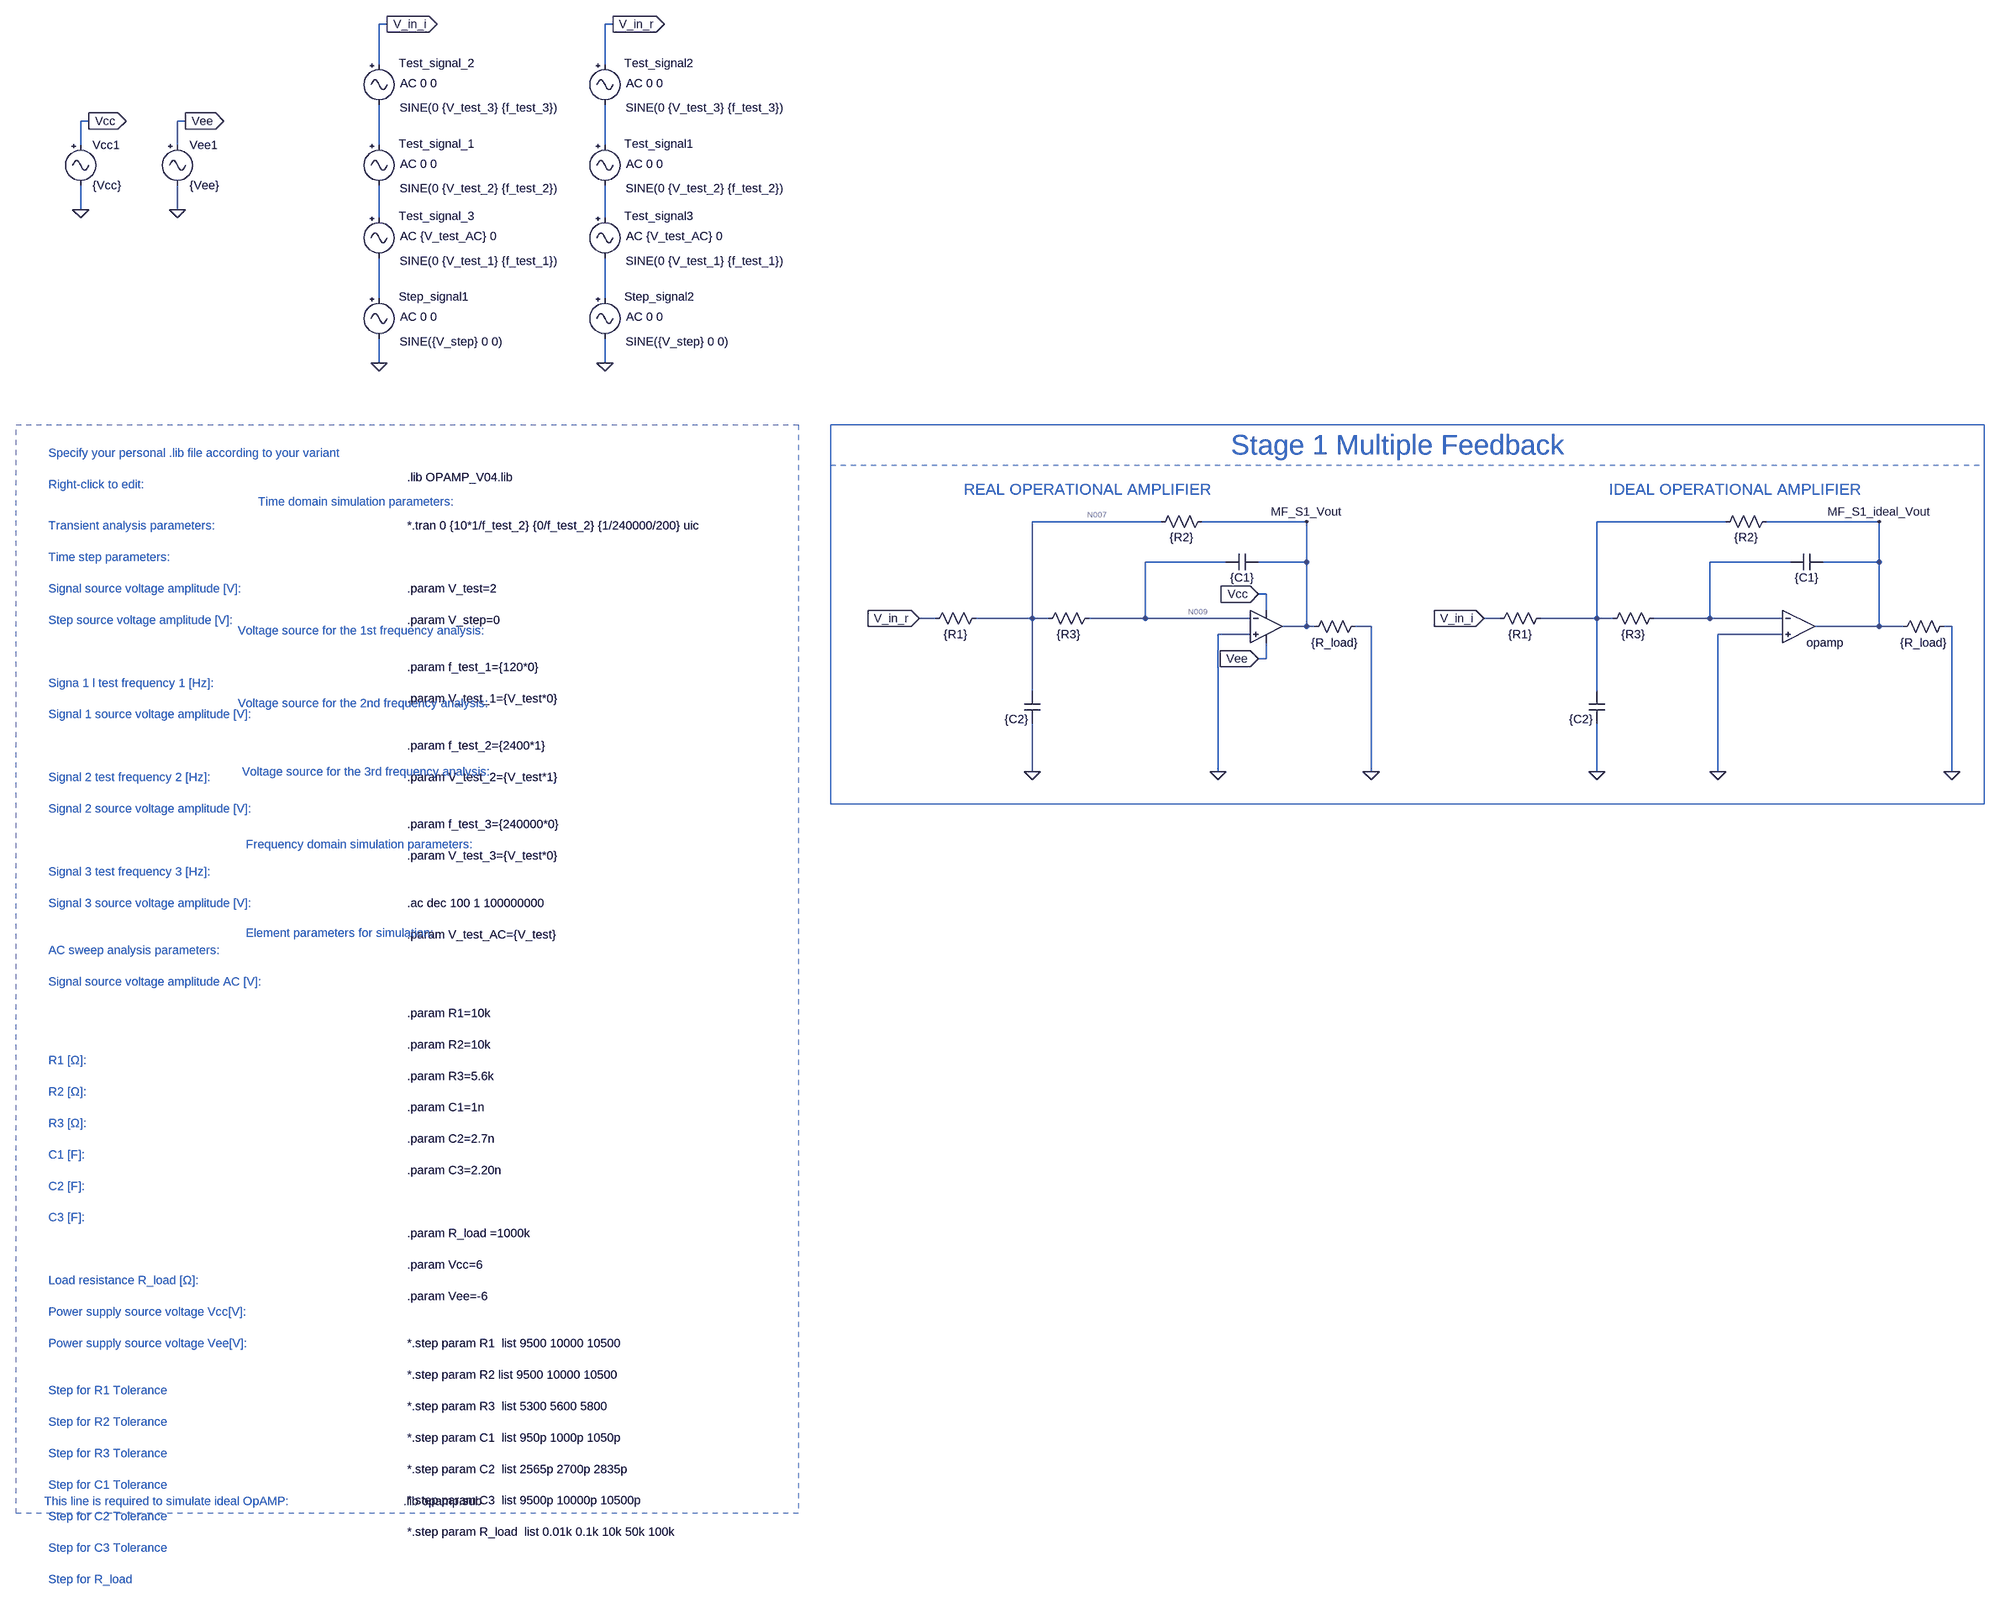
[diagram p0: schematic Lab3. OpAmp_Filter_v2.0.asc]
Lab3. OpAmp_Filter_v2.0.asc, the LTspice schematic file:
Version 4
SHEET 1 6772 2844
WIRE -1392 -1440 -1408 -1440
WIRE -944 -1440 -960 -1440
WIRE -1408 -1360 -1408 -1440
WIRE -960 -1360 -960 -1440
WIRE -1984 -1248 -2000 -1248
WIRE -1792 -1248 -1808 -1248
WIRE -2000 -1200 -2000 -1248
WIRE -1808 -1200 -1808 -1248
WIRE -1408 -1200 -1408 -1280
WIRE -960 -1200 -960 -1280
WIRE -2000 -1072 -2000 -1120
WIRE -1808 -1072 -1808 -1120
WIRE -1408 -1056 -1408 -1120
WIRE -960 -1056 -960 -1120
WIRE -1408 -896 -1408 -976
WIRE -960 -896 -960 -976
WIRE -1408 -768 -1408 -816
WIRE -960 -768 -960 -816
WIRE 144 -448 -112 -448
WIRE 432 -448 224 -448
WIRE 1264 -448 1008 -448
WIRE 1568 -448 1344 -448
WIRE 272 -368 112 -368
WIRE 432 -368 432 -448
WIRE 432 -368 336 -368
WIRE 1392 -368 1232 -368
WIRE 1568 -368 1568 -448
WIRE 1568 -368 1456 -368
WIRE 352 -304 336 -304
WIRE 352 -272 352 -304
WIRE -304 -256 -336 -256
WIRE -112 -256 -112 -448
WIRE -112 -256 -224 -256
WIRE -80 -256 -112 -256
WIRE 112 -256 112 -368
WIRE 112 -256 0 -256
WIRE 320 -256 112 -256
WIRE 816 -256 784 -256
WIRE 1008 -256 1008 -448
WIRE 1008 -256 896 -256
WIRE 1040 -256 1008 -256
WIRE 1232 -256 1232 -368
WIRE 1232 -256 1120 -256
WIRE 1376 -256 1232 -256
WIRE 432 -240 432 -368
WIRE 432 -240 384 -240
WIRE 448 -240 432 -240
WIRE 560 -240 528 -240
WIRE 1568 -240 1568 -368
WIRE 1568 -240 1440 -240
WIRE 1616 -240 1568 -240
WIRE 1712 -240 1696 -240
WIRE 320 -224 256 -224
WIRE 1376 -224 1248 -224
WIRE 352 -176 352 -208
WIRE 352 -176 336 -176
WIRE -112 -112 -112 -256
WIRE 1008 -112 1008 -256
WIRE -112 48 -112 -48
WIRE 256 48 256 -224
WIRE 560 48 560 -240
WIRE 1008 48 1008 -48
WIRE 1248 48 1248 -224
WIRE 1712 48 1712 -240
FLAG 256 48 0
FLAG 336 -304 Vcc
IOPIN 336 -304 In
FLAG 336 -176 Vee
IOPIN 336 -176 In
FLAG 432 -448 MF_S1_Vout
FLAG -336 -256 V_in_r
IOPIN -336 -256 In
FLAG 560 48 0
FLAG -112 48 0
FLAG 1248 48 0
FLAG 1568 -448 MF_S1_ideal_Vout
FLAG 784 -256 V_in_i
IOPIN 784 -256 In
FLAG 1712 48 0
FLAG 1008 48 0
FLAG -2000 -1072 0
FLAG -1808 -1072 0
FLAG -1984 -1248 Vcc
IOPIN -1984 -1248 Out
FLAG -1792 -1248 Vee
IOPIN -1792 -1248 Out
FLAG -1408 -768 0
FLAG -1392 -1440 V_in_i
IOPIN -1392 -1440 Out
FLAG -960 -768 0
FLAG -944 -1440 V_in_r
IOPIN -944 -1440 Out
SYMBOL OpAmps\\opamp2 352 -304 R0
WINDOW 0 16 32 Invisible 2
WINDOW 3 16 96 Invisible 2
SYMATTR InstName U3
SYMATTR Value OPAMP_VarNo
SYMBOL res 544 -256 R90
WINDOW 0 0 56 Invisible 2
WINDOW 3 33 56 VTop 2
SYMATTR InstName R10
SYMATTR Value {R_load}
SYMBOL res 1712 -256 R90
WINDOW 0 0 56 Invisible 2
WINDOW 3 33 56 VTop 2
SYMATTR InstName R31
SYMATTR Value {R_load}
SYMBOL OpAmps\\opamp 1408 -304 R0
WINDOW 0 0 32 Invisible 2
SYMATTR InstName U4
SYMATTR SpiceLine2 GBW=100Meg
SYMBOL res -208 -272 R90
WINDOW 0 0 56 Invisible 2
WINDOW 3 32 56 VTop 2
SYMATTR InstName R32
SYMATTR Value {R1}
SYMATTR SpiceLine tol=10
SYMBOL res 240 -464 R90
WINDOW 0 0 56 Invisible 2
WINDOW 3 32 56 VTop 2
SYMATTR InstName R33
SYMATTR Value {R2}
SYMBOL cap 336 -384 R90
WINDOW 0 0 32 Invisible 2
WINDOW 3 32 32 VTop 2
SYMATTR InstName C20
SYMATTR Value {C1}
SYMBOL cap 1456 -384 R90
WINDOW 0 0 32 Invisible 2
WINDOW 3 32 32 VTop 2
SYMATTR InstName C21
SYMATTR Value {C1}
SYMBOL res 1360 -464 R90
WINDOW 0 0 56 Invisible 2
WINDOW 3 32 56 VTop 2
SYMATTR InstName R34
SYMATTR Value {R2}
SYMBOL res 1136 -272 R90
WINDOW 0 0 56 Invisible 2
WINDOW 3 32 56 VTop 2
SYMATTR InstName R35
SYMATTR Value {R3}
SYMBOL res 912 -272 R90
WINDOW 0 0 56 Invisible 2
WINDOW 3 32 56 VTop 2
SYMATTR InstName R36
SYMATTR Value {R1}
SYMATTR SpiceLine tol=10
SYMBOL res 16 -272 R90
WINDOW 0 0 56 Invisible 2
WINDOW 3 32 56 VTop 2
SYMATTR InstName R37
SYMATTR Value {R3}
SYMBOL cap -96 -48 R180
WINDOW 0 24 56 Invisible 2
WINDOW 3 24 8 Left 2
SYMATTR InstName C22
SYMATTR Value {C2}
SYMBOL cap 1024 -48 R180
WINDOW 0 24 56 Invisible 2
WINDOW 3 24 8 Left 2
SYMATTR InstName C23
SYMATTR Value {C2}
SYMBOL Misc\\signal -1408 -912 R0
WINDOW 123 42 53 Left 2
WINDOW 39 0 0 Left 0
WINDOW 0 39 13 Left 2
WINDOW 3 41 102 Left 2
SYMATTR Value2 AC 0 0
SYMATTR InstName Step_signal1
SYMATTR Value SINE({V_step} 0 0)
SYMBOL Misc\\signal -1808 -1216 R0
WINDOW 123 0 0 Left 0
WINDOW 39 0 0 Left 0
SYMATTR InstName Vee1
SYMATTR Value {Vee}
SYMBOL Misc\\signal -2000 -1216 R0
WINDOW 123 0 0 Left 0
WINDOW 39 0 0 Left 0
SYMATTR InstName Vcc1
SYMATTR Value {Vcc}
SYMBOL Misc\\signal -1408 -1216 R0
WINDOW 123 42 53 Left 2
WINDOW 39 0 0 Left 0
WINDOW 0 39 13 Left 2
WINDOW 3 41 102 Left 2
SYMATTR Value2 AC 0 0
SYMATTR InstName Test_signal_1
SYMATTR Value SINE(0 {V_test_2} {f_test_2})
SYMBOL Misc\\signal -1408 -1376 R0
WINDOW 123 42 53 Left 2
WINDOW 39 0 0 Left 0
WINDOW 0 39 13 Left 2
WINDOW 3 41 102 Left 2
SYMATTR Value2 AC 0 0
SYMATTR InstName Test_signal_2
SYMATTR Value SINE(0 {V_test_3} {f_test_3})
SYMBOL Misc\\signal -1408 -1072 R0
WINDOW 123 42 53 Left 2
WINDOW 39 0 0 Left 0
WINDOW 0 39 13 Left 2
WINDOW 3 41 102 Left 2
SYMATTR Value2 AC {V_test_AC} 0
SYMATTR InstName Test_signal_3
SYMATTR Value SINE(0 {V_test_1} {f_test_1})
SYMBOL Misc\\signal -960 -912 R0
WINDOW 123 42 53 Left 2
WINDOW 39 0 0 Left 0
WINDOW 0 39 13 Left 2
WINDOW 3 41 102 Left 2
SYMATTR Value2 AC 0 0
SYMATTR InstName Step_signal2
SYMATTR Value SINE({V_step} 0 0)
SYMBOL Misc\\signal -960 -1216 R0
WINDOW 123 42 53 Left 2
WINDOW 39 0 0 Left 0
WINDOW 0 39 13 Left 2
WINDOW 3 41 102 Left 2
SYMATTR Value2 AC 0 0
SYMATTR InstName Test_signal1
SYMATTR Value SINE(0 {V_test_2} {f_test_2})
SYMBOL Misc\\signal -960 -1376 R0
WINDOW 123 42 53 Left 2
WINDOW 39 0 0 Left 0
WINDOW 0 39 13 Left 2
WINDOW 3 41 102 Left 2
SYMATTR Value2 AC 0 0
SYMATTR InstName Test_signal2
SYMATTR Value SINE(0 {V_test_3} {f_test_3})
SYMBOL Misc\\signal -960 -1072 R0
WINDOW 123 42 53 Left 2
WINDOW 39 0 0 Left 0
WINDOW 0 39 13 Left 2
WINDOW 3 41 102 Left 2
SYMATTR Value2 AC {V_test_AC} 0
SYMATTR InstName Test_signal3
SYMATTR Value SINE(0 {V_test_1} {f_test_1})
TEXT 1032 -512 Left 3 ;IDEAL OPERATIONAL AMPLIFIER
TEXT -248 -512 Left 3 ;REAL OPERATIONAL AMPLIFIER
TEXT 616 -600 Center 5 ;Stage 1 Multiple Feedback
TEXT -1352 -440 Left 2 !*.tran 0 {10*1/f_test_2} {0/f_test_2} {1/240000/200} uic\n \n \n \n.param V_test=2\n \n.param V_step=0\n \n \n.param f_test_1={120*0}\n \n.param V_test_1={V_test*0}\n \n \n.param f_test_2={2400*1}\n \n.param V_test_2={V_test*1}\n \n \n.param f_test_3={240000*0}\n \n.param V_test_3={V_test*0}\n \n \n.ac dec 100 1 100000000\n \n.param V_test_AC={V_test}\n \n \n \n  \n.param R1=10k\n \n.param R2=10k\n \n.param R3=5.6k\n \n.param C1=1n\n \n.param C2=2.7n\n \n.param C3=2.20n\n \n \n \n.param R_load =1000k\n \n.param Vcc=6\n \n.param Vee=-6\n \n  \n*.step param R1  list 9500 10000 10500\n \n*.step param R2 list 9500 10000 10500\n \n*.step param R3  list 5300 5600 5800\n \n*.step param C1  list 950p 1000p 1050p\n \n*.step param C2  list 2565p 2700p 2835p\n \n*.step param C3  list 9500p 10000p 10500p\n \n*.step param R_load  list 0.01k 0.1k 10k 50k 100k
TEXT -1352 -536 Left 2 !.lib OPAMP_V04.lib
TEXT -2064 -584 Left 2 ;Specify your personal .lib file according to your variant\n \nRight-click to edit:
TEXT -1648 -488 Left 2 ;Time domain simulation parameters:
TEXT -1672 368 Left 2 ;Element parameters for simulation:
TEXT -2064 -440 Left 2 ;Transient analysis parameters:\n \nTime step parameters:\n \nSignal source voltage amplitude [V]:\n \nStep source voltage amplitude [V]:\n \n \n\nSigna 1 l test frequency 1 [Hz]:\n \nSignal 1 source voltage amplitude [V]:\n \n \n\nSignal 2 test frequency 2 [Hz]:\n \nSignal 2 source voltage amplitude [V]:\n \n \n\nSignal 3 test frequency 3 [Hz]:\n \nSignal 3 source voltage amplitude [V]:\n \n \nAC sweep analysis parameters:\n \nSignal source voltage amplitude AC [V]:\n  \n \n \n \nR1 [Ω]:\n \nR2 [Ω]:\n \nR3 [Ω]:\n \nC1 [F]:\n \nC2 [F]:\n \nC3 [F]:\n \n \n \nLoad resistance R_load [Ω]:\n \nPower supply source voltage Vcc[V]:\n \nPower supply source voltage Vee[V]: \n \n \nStep for R1 Tolerance\n \nStep for R2 Tolerance\n \nStep for R3 Tolerance\n \nStep for C1 Tolerance \n \nStep for C2 Tolerance\n \nStep for C3 Tolerance \n \nStep for R_load
TEXT -1360 1496 Left 2 !.lib opamp.sub
TEXT -2072 1496 Left 2 ;This line is required to simulate ideal OpAMP:
TEXT -1672 192 Left 2 ;Frequency domain simulation parameters:
TEXT -1688 -232 Left 2 ;Voltage source for the 1st frequency analysis:
TEXT -1688 -88 Left 2 ;Voltage source for the 2nd frequency analysis:
TEXT -1680 48 Left 2 ;Voltage source for the 3rd frequency analysis:
RECTANGLE Normal 1776 112 -512 -560 2
RECTANGLE Normal 1776 112 -512 -640
RECTANGLE Normal -576 1520 -2128 -640 2

The netlist it stands for:
* Lab3. OpAmp_Filter_v2.0.asc
XU3 0 N009 Vcc Vee MF_S1_Vout OPAMP_VarNo  ; pins In+ In- V+ V- OUT
R10 0 MF_S1_Vout {R_load}
R31 0 MF_S1_ideal_Vout {R_load}
XU4 N010 0 MF_S1_ideal_Vout opamp Aol=100K GBW=100Meg  ; pins invin noninvin out
R32 N007 V_in_r {R1} tol=10
R33 MF_S1_Vout N007 {R2}
C20 MF_S1_Vout N009 {C1}
C21 MF_S1_ideal_Vout N010 {C1}
R34 MF_S1_ideal_Vout N008 {R2}
R35 N010 N008 {R3}
R36 N008 V_in_i {R1} tol=10
R37 N009 N007 {R3}
C22 0 N007 {C2}
C23 0 N008 {C2}
V§Step_signal1 N005 0 SINE({V_step} 0 0) AC 0 0
Vee1 Vee 0 {Vee}
Vcc1 Vcc 0 {Vcc}
V§Test_signal_1 N001 N003 SINE(0 {V_test_2} {f_test_2}) AC 0 0
V§Test_signal_2 V_in_i N001 SINE(0 {V_test_3} {f_test_3}) AC 0 0
V§Test_signal_3 N003 N005 SINE(0 {V_test_1} {f_test_1}) AC {V_test_AC} 0
V§Step_signal2 N006 0 SINE({V_step} 0 0) AC 0 0
V§Test_signal1 N002 N004 SINE(0 {V_test_2} {f_test_2}) AC 0 0
V§Test_signal2 V_in_r N002 SINE(0 {V_test_3} {f_test_3}) AC 0 0
V§Test_signal3 N004 N006 SINE(0 {V_test_1} {f_test_1}) AC {V_test_AC} 0
* IDEAL OPERATIONAL AMPLIFIER
* REAL OPERATIONAL AMPLIFIER
* Stage 1 Multiple Feedback
*.tran 0 {10*1/f_test_2} {0/f_test_2} {1/240000/200} uic
.param V_test=2
.param V_step=0
.param f_test_1={120*0}
.param V_test_1={V_test*0}
.param f_test_2={2400*1}
.param V_test_2={V_test*1}
.param f_test_3={240000*0}
.param V_test_3={V_test*0}
.ac dec 100 1 100000000
.param V_test_AC={V_test}
.param R1=10k
.param R2=10k
.param R3=5.6k
.param C1=1n
.param C2=2.7n
.param C3=2.20n
.param R_load =1000k
.param Vcc=6
.param Vee=-6
*.step param R1  list 9500 10000 10500
*.step param R2 list 9500 10000 10500
*.step param R3  list 5300 5600 5800
*.step param C1  list 950p 1000p 1050p
*.step param C2  list 2565p 2700p 2835p
*.step param C3  list 9500p 10000p 10500p
*.step param R_load  list 0.01k 0.1k 10k 50k 100k
.lib OPAMP_V04.lib
* Specify your personal .lib file according to your variant
* Right-click to edit:
* Time domain simulation parameters:
* Element parameters for simulation:
* Transient analysis parameters:
* Time step parameters:
* Signal source voltage amplitude [V]:
* Step source voltage amplitude [V]:
* Signa 1 l test frequency 1 [Hz]:
* Signal 1 source voltage amplitude [V]:
* Signal 2 test frequency 2 [Hz]:
* Signal 2 source voltage amplitude [V]:
* Signal 3 test frequency 3 [Hz]:
* Signal 3 source voltage amplitude [V]:
* AC sweep analysis parameters:
* Signal source voltage amplitude AC [V]:
* R1 [Ω]:
* R2 [Ω]:
* R3 [Ω]:
* C1 [F]:
* C2 [F]:
* C3 [F]:
* Load resistance R_load [Ω]:
* Power supply source voltage Vcc[V]:
* Power supply source voltage Vee[V]:
* Step for R1 Tolerance
* Step for R2 Tolerance
* Step for R3 Tolerance
* Step for C1 Tolerance
* Step for C2 Tolerance
* Step for C3 Tolerance
* Step for R_load
.lib opamp.sub
* This line is required to simulate ideal OpAMP:
* Frequency domain simulation parameters:
* Voltage source for the 1st frequency analysis:
* Voltage source for the 2nd frequency analysis:
* Voltage source for the 3rd frequency analysis:
.backanno
.end

* Results of the author's LTspice run, read from the files saved beside the schematic
* Operating Point, zero values left out:
*   V(vcc) = 6 V
*   V(vee) = -6 V
*   V(n009) = -2.5 mV
*   V(mf_s1_vout) = -4.999 mV
*   V(n007) = -2.5 mV
*   I(R37) = 2.468 pA
*   I(R33) = -250 nA
*   I(R32) = -250 nA
*   I(R10) = 4.999 nA
*   I(Test_signal3) = -250 nA
*   I(Test_signal2) = -250 nA
*   I(Test_signal1) = -250 nA
*   I(Step_signal2) = -250 nA
*   I(Vcc1) = -4.401 mA
*   I(Vee1) = 4.401 mA
*   Ix(u3:100) = -2.532 pA
*   Ix(u3:101) = -2.468 pA
*   Ix(u3:102) = 4.401 mA
*   Ix(u3:103) = -4.401 mA
*   Ix(u3:104) = 255 nA
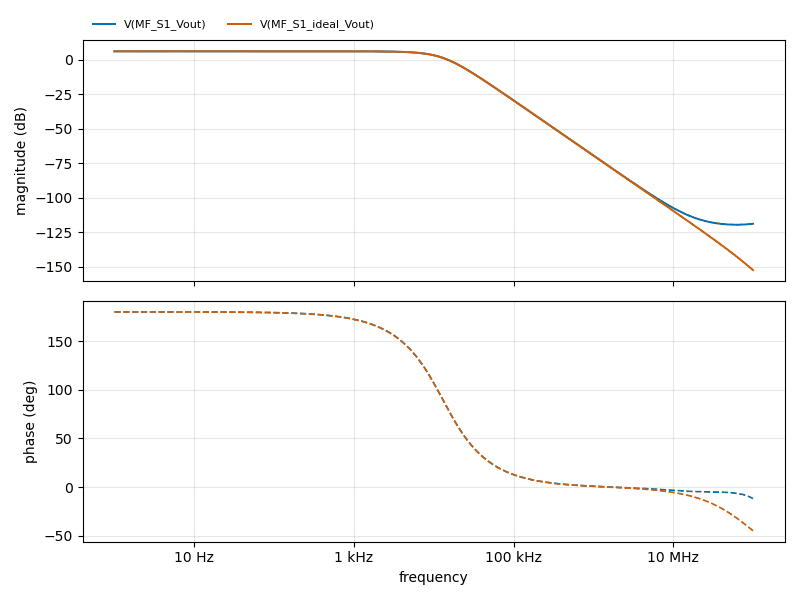
[diagram p1: AC Analysis of Lab3. OpAmp_Filter_v2.0.asc, plotted from the saved traces]
* AC Analysis, 1 run:
*   V(MF_S1_Vout): 6.02 dB at 1 Hz, -118.87 dB at 100 MHz, peak 6.02 dB at 1 Hz, 3 dB below the peak at 10.24 kHz
*   V(MF_S1_ideal_Vout): 6.02 dB at 1 Hz, -152.51 dB at 100 MHz, peak 6.02 dB at 1 Hz, 3 dB below the peak at 10.24 kHz